# Altium schematic sheet Sheet1.SchDoc
size A
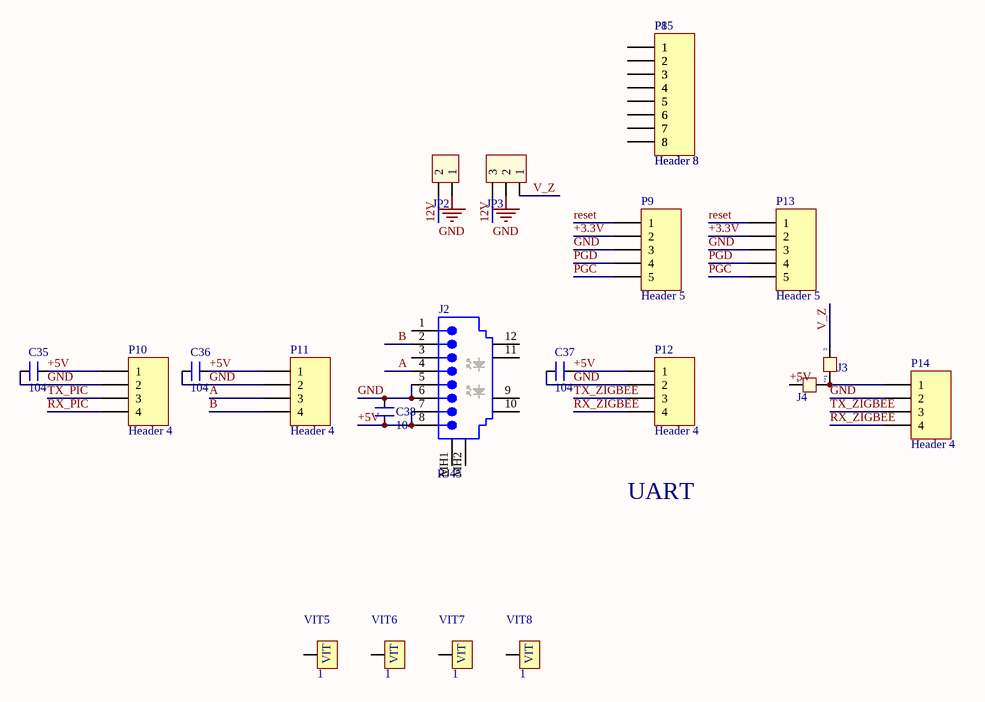
[diagram p0: Sheet1.SchDoc]

## Parts
C35  104  [SM-0805]
C36  104  [SM-0805]
C37  104  [SM-0805]
C38  104  [SM-0805]
J2  RJ45  [RJ45]
J3  Jumper 2  [SM-0805]  (value not drawn)
J4  Jumper 2  [SM-0805]  (value not drawn)
JP2  Connector 2  [CON2]  (value not drawn)
JP3  Connector 3  [CON3]  (value not drawn)
P8  Header 8  [con8]
P9  Header 5  [CON5]
P10  Header 4  [CON4]
P11  Header 4  [CON4]
P12  Header 4  [CON4]
P13  Header 5  [CON5]
P14  Header 4  [CON4]
P15  Header 8  [con8]
VIT5  1  [VIT]
VIT6  1  [VIT]
VIT7  1  [VIT]
VIT8  1  [VIT]

## Nets
GND: C35.2 C36.2 C37.1 C38.1 J2.5 J2.6 JP2.1 JP3.2 P9.3 P10.2 P11.2 P12.2 P13.3 P14.2
12V: JP2.2 JP3.3
+3.3V: P9.2 P13.2
+5V: C35.1 C36.1 C37.2 C38.2 J2.7 J2.8 J4.1 P10.1 P11.1 P12.1
A: J2.4 P11.3
B: J2.2 P11.4
PGC: P9.5 P13.5
PGD: P9.4 P13.4
reset: P9.1 P13.1
RX_PIC: P10.4
RX_ZIGBEE: P12.4 P14.4
TX_PIC: P10.3
TX_ZIGBEE: P12.3 P14.3
V_Z: J3.2 JP3.1
NetJ3_1: J3.1 J4.2 P14.1
NetP8_1: P8.1 P15.1
NetP8_2: P8.2 P15.2
NetP8_3: P8.3 P15.3
NetP8_4: P8.4 P15.4
NetP8_5: P8.5 P15.5
NetP8_6: P8.6 P15.6
NetP8_7: P8.7 P15.7
NetP8_8: P8.8 P15.8

Not connected (* = marked no-connect by the designer): J2 1 3 9 10 11 12 MH1(Shield) MH2(Shield); VIT5 VIT1(1); VIT6 VIT1(1); VIT7 VIT1(1); VIT8 VIT1(1)

## Notes on the sheet
- UART

## Library data of the parts
C35-C38 = CM: Cap SMD; Value: 103
J2 = RJ45: RJ45 Connector, with Leds
J3 J4 = JP 2: Value: JP 2
JP2 = CON2: Value: Connector 2
JP3 = CON3: Value: Connector 3
P8 P15 = Header 8: Header, 8-Pin; LatestRevisionDate: 17-Jul-2002; LatestRevisionNote: Re-released for DXP Platform.; Publisher: Altium Limited
P9 P13 = Header 5: Header, 5-Pin; LatestRevisionDate: 17-Jul-2002; LatestRevisionNote: Re-released for DXP Platform.; Publisher: Altium Limited
P10-P12 P14 = Header 4: Header, 4-Pin; LatestRevisionDate: 17-Jul-2002; LatestRevisionNote: Re-released for DXP Platform.; Publisher: Altium Limited
VIT5-VIT8 = VIT: Oc Vit